# EAGLE design pcb-pick-plaz-led (EAGLE 9.6.2)
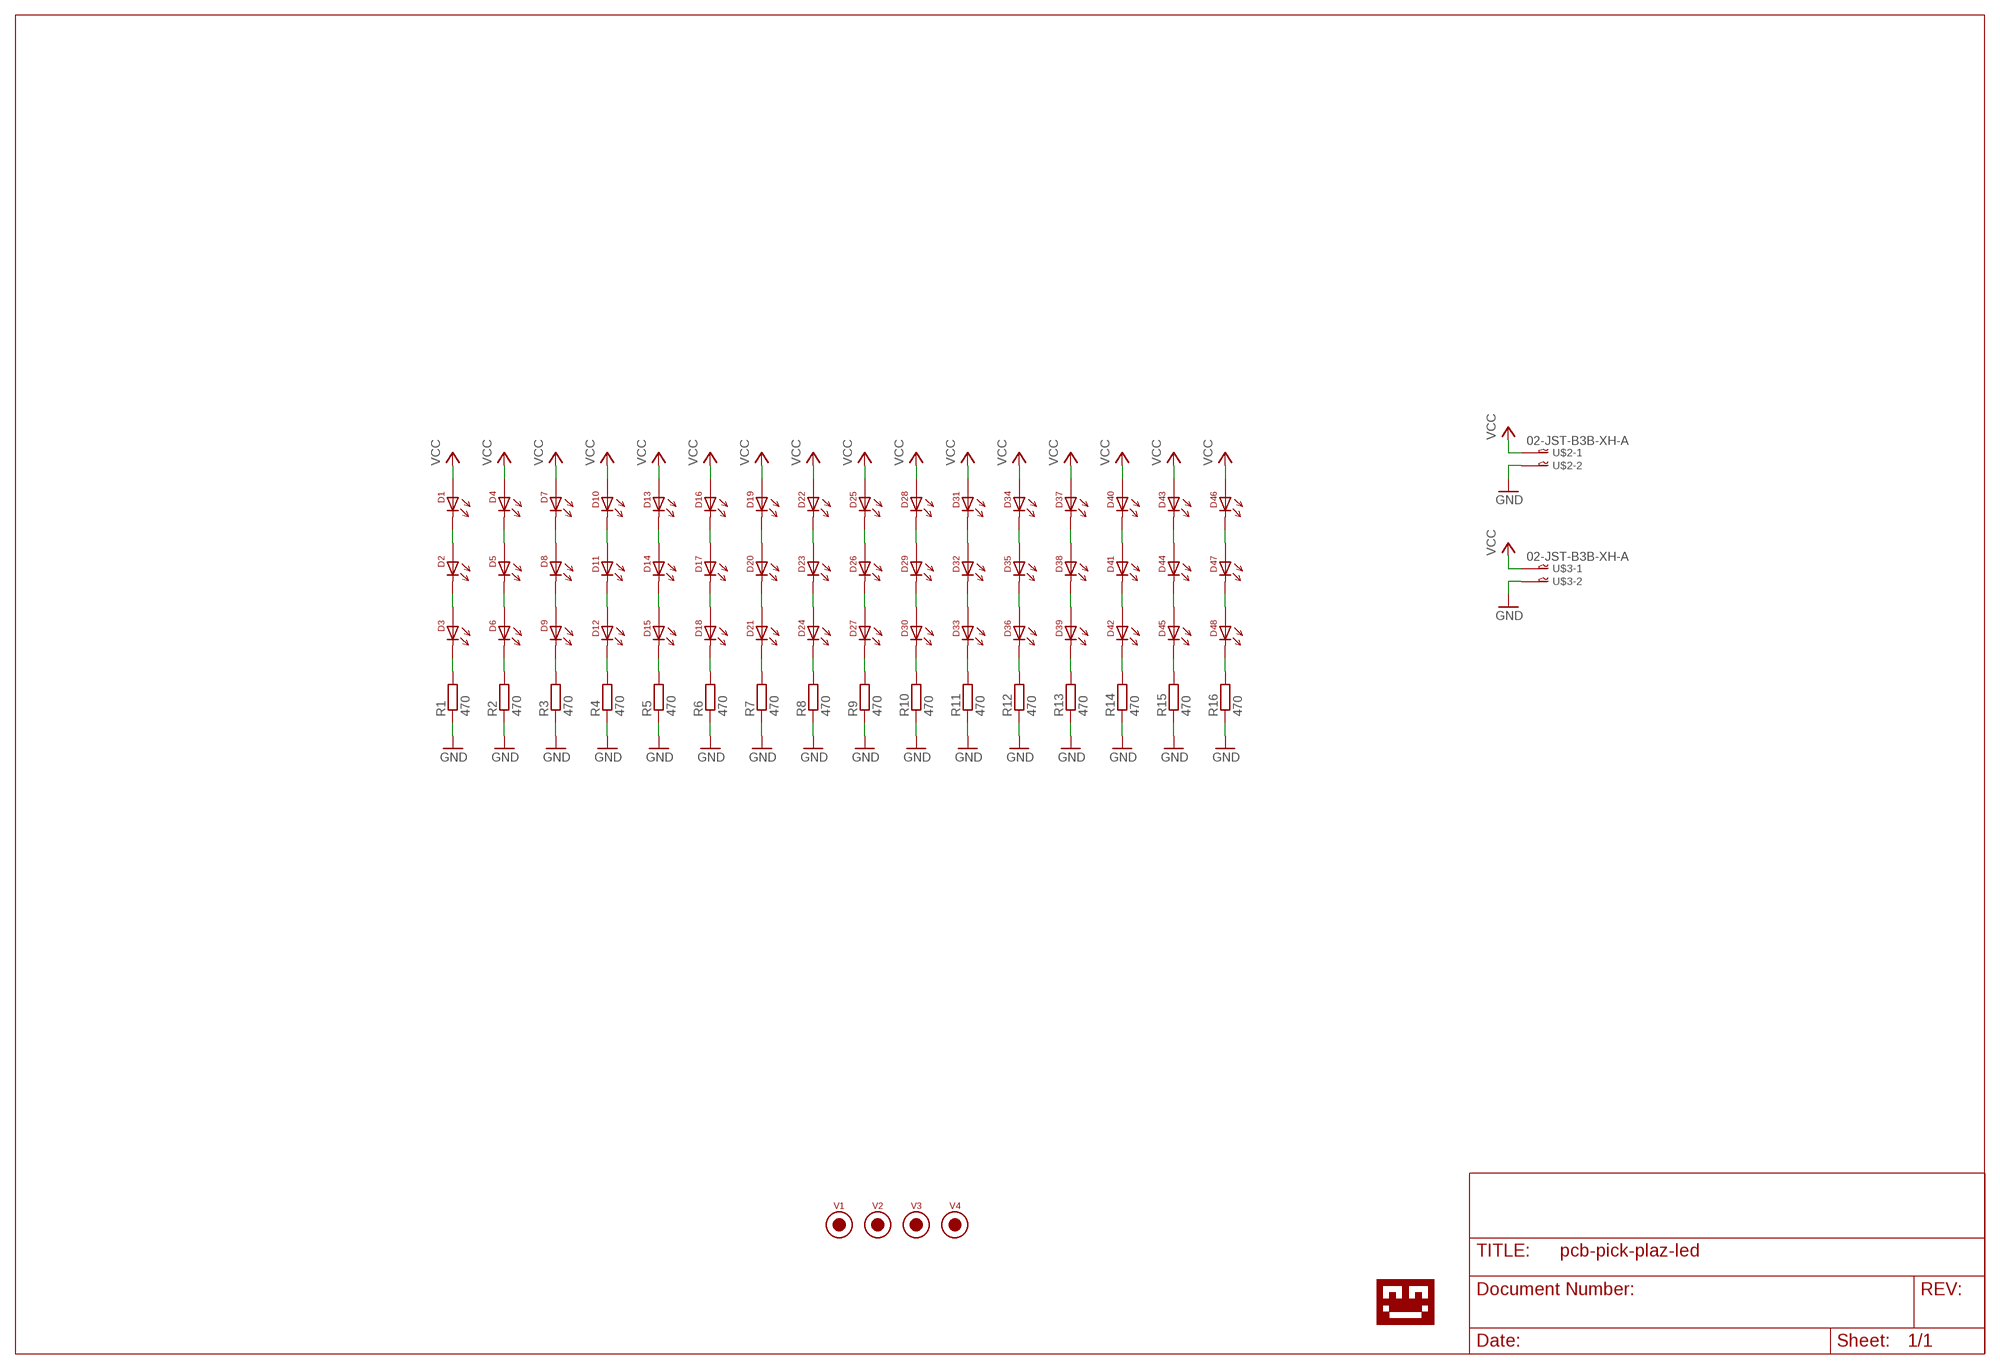
[diagram p0: schematic, sheet 1]

## Parts
D1  LED-5730  [5730-LED]
D2  LED-5730  [5730-LED]
D3  LED-5730  [5730-LED]
D4  LED-5730  [5730-LED]
D5  LED-5730  [5730-LED]
D6  LED-5730  [5730-LED]
D7  LED-5730  [5730-LED]
D8  LED-5730  [5730-LED]
D9  LED-5730  [5730-LED]
D10  LED-5730  [5730-LED]
D11  LED-5730  [5730-LED]
D12  LED-5730  [5730-LED]
D13  LED-5730  [5730-LED]
D14  LED-5730  [5730-LED]
D15  LED-5730  [5730-LED]
D16  LED-5730  [5730-LED]
D17  LED-5730  [5730-LED]
D18  LED-5730  [5730-LED]
D19  LED-5730  [5730-LED]
D20  LED-5730  [5730-LED]
D21  LED-5730  [5730-LED]
D22  LED-5730  [5730-LED]
D23  LED-5730  [5730-LED]
D24  LED-5730  [5730-LED]
D25  LED-5730  [5730-LED]
D26  LED-5730  [5730-LED]
D27  LED-5730  [5730-LED]
D28  LED-5730  [5730-LED]
D29  LED-5730  [5730-LED]
D30  LED-5730  [5730-LED]
D31  LED-5730  [5730-LED]
D32  LED-5730  [5730-LED]
D33  LED-5730  [5730-LED]
D34  LED-5730  [5730-LED]
D35  LED-5730  [5730-LED]
D36  LED-5730  [5730-LED]
D37  LED-5730  [5730-LED]
D38  LED-5730  [5730-LED]
D39  LED-5730  [5730-LED]
D40  LED-5730  [5730-LED]
D41  LED-5730  [5730-LED]
D42  LED-5730  [5730-LED]
D43  LED-5730  [5730-LED]
D44  LED-5730  [5730-LED]
D45  LED-5730  [5730-LED]
D46  LED-5730  [5730-LED]
D47  LED-5730  [5730-LED]
D48  LED-5730  [5730-LED]
R1  470  RESISTOR0805_RES  [0805_RES]
R2  470  RESISTOR0805_RES  [0805_RES]
R3  470  RESISTOR0805_RES  [0805_RES]
R4  470  RESISTOR0805_RES  [0805_RES]
R5  470  RESISTOR0805_RES  [0805_RES]
R6  470  RESISTOR0805_RES  [0805_RES]
R7  470  RESISTOR0805_RES  [0805_RES]
R8  470  RESISTOR0805_RES  [0805_RES]
R9  470  RESISTOR0805_RES  [0805_RES]
R10  470  RESISTOR0805_RES  [0805_RES]
R11  470  RESISTOR0805_RES  [0805_RES]
R12  470  RESISTOR0805_RES  [0805_RES]
R13  470  RESISTOR0805_RES  [0805_RES]
R14  470  RESISTOR0805_RES  [0805_RES]
R15  470  RESISTOR0805_RES  [0805_RES]
R16  470  RESISTOR0805_RES  [0805_RES]
U$1  LOGO-TOBENG-1MM-FINISH  [TOBENG-1MM-FINISH]
U$2  02-JST-B3B-XH-A  [B2B-XH]
U$3  02-JST-B3B-XH-A  [B2B-XH]
V1  FIDUCIAL2MM  [FIDUCIAL_2MM]
V2  FIDUCIAL2MM  [FIDUCIAL_2MM]
V3  FIDUCIAL2MM  [FIDUCIAL_2MM]
V4  FIDUCIAL2MM  [FIDUCIAL_2MM]

## Nets
GND: R1.1 R2.1 R3.1 R4.1 R5.1 R6.1 R7.1 R8.1 R9.1 R10.1 R11.1 R12.1 R13.1 R14.1 R15.1 R16.1 U$2.P$2 U$3.P$2
N$1: D1.C D2.A1 D2.A2
N$2: D2.C D3.A1 D3.A2
N$3: D3.C R1.2
N$4: D4.C D5.A1 D5.A2
N$5: D5.C D6.A1 D6.A2
N$6: D6.C R2.2
N$7: D7.C D8.A1 D8.A2
N$8: D8.C D9.A1 D9.A2
N$9: D9.C R3.2
N$10: D10.C D11.A1 D11.A2
N$11: D11.C D12.A1 D12.A2
N$12: D12.C R4.2
N$13: D13.C D14.A1 D14.A2
N$14: D14.C D15.A1 D15.A2
N$15: D15.C R5.2
N$16: D16.C D17.A1 D17.A2
N$17: D17.C D18.A1 D18.A2
N$18: D18.C R6.2
N$19: D19.C D20.A1 D20.A2
N$20: D20.C D21.A1 D21.A2
N$21: D21.C R7.2
N$22: D22.C D23.A1 D23.A2
N$23: D23.C D24.A1 D24.A2
N$24: D24.C R8.2
N$25: D25.C D26.A1 D26.A2
N$26: D26.C D27.A1 D27.A2
N$27: D27.C R9.2
N$28: D28.C D29.A1 D29.A2
N$29: D29.C D30.A1 D30.A2
N$30: D30.C R10.2
N$31: D31.C D32.A1 D32.A2
N$32: D32.C D33.A1 D33.A2
N$33: D33.C R11.2
N$34: D34.C D35.A1 D35.A2
N$35: D35.C D36.A1 D36.A2
N$36: D36.C R12.2
N$37: D37.C D38.A1 D38.A2
N$38: D38.C D39.A1 D39.A2
N$39: D39.C R13.2
N$40: D40.C D41.A1 D41.A2
N$41: D41.C D42.A1 D42.A2
N$42: D42.C R14.2
N$43: D43.C D44.A1 D44.A2
N$44: D44.C D45.A1 D45.A2
N$45: D45.C R15.2
N$46: D46.C D47.A1 D47.A2
N$47: D47.C D48.A1 D48.A2
N$48: D48.C R16.2
VCC: D1.A1 D1.A2 D4.A1 D4.A2 D7.A1 D7.A2 D10.A1 D10.A2 D13.A1 D13.A2 D16.A1 D16.A2 D19.A1 D19.A2 D22.A1 D22.A2 D25.A1 D25.A2 D28.A1 D28.A2 D31.A1 D31.A2 D34.A1 D34.A2 D37.A1 D37.A2 D40.A1 D40.A2 D43.A1 D43.A2 D46.A1 D46.A2 U$2.P$1 U$3.P$1

## Library data of the parts
D1-D48 = ftobler:LED
R1-R16 = passives:RESISTOR: Resistor Basic schematic elements and footprints for 0201, 0402, 0603, 1206, and PTH resistors.
U$1 = ftobler:LOGO
U$2 U$3 = bt_con-jst-xh:02-JST: JST CONNECTOR
V1-V4 = ftobler:FIDUCIAL

## Board
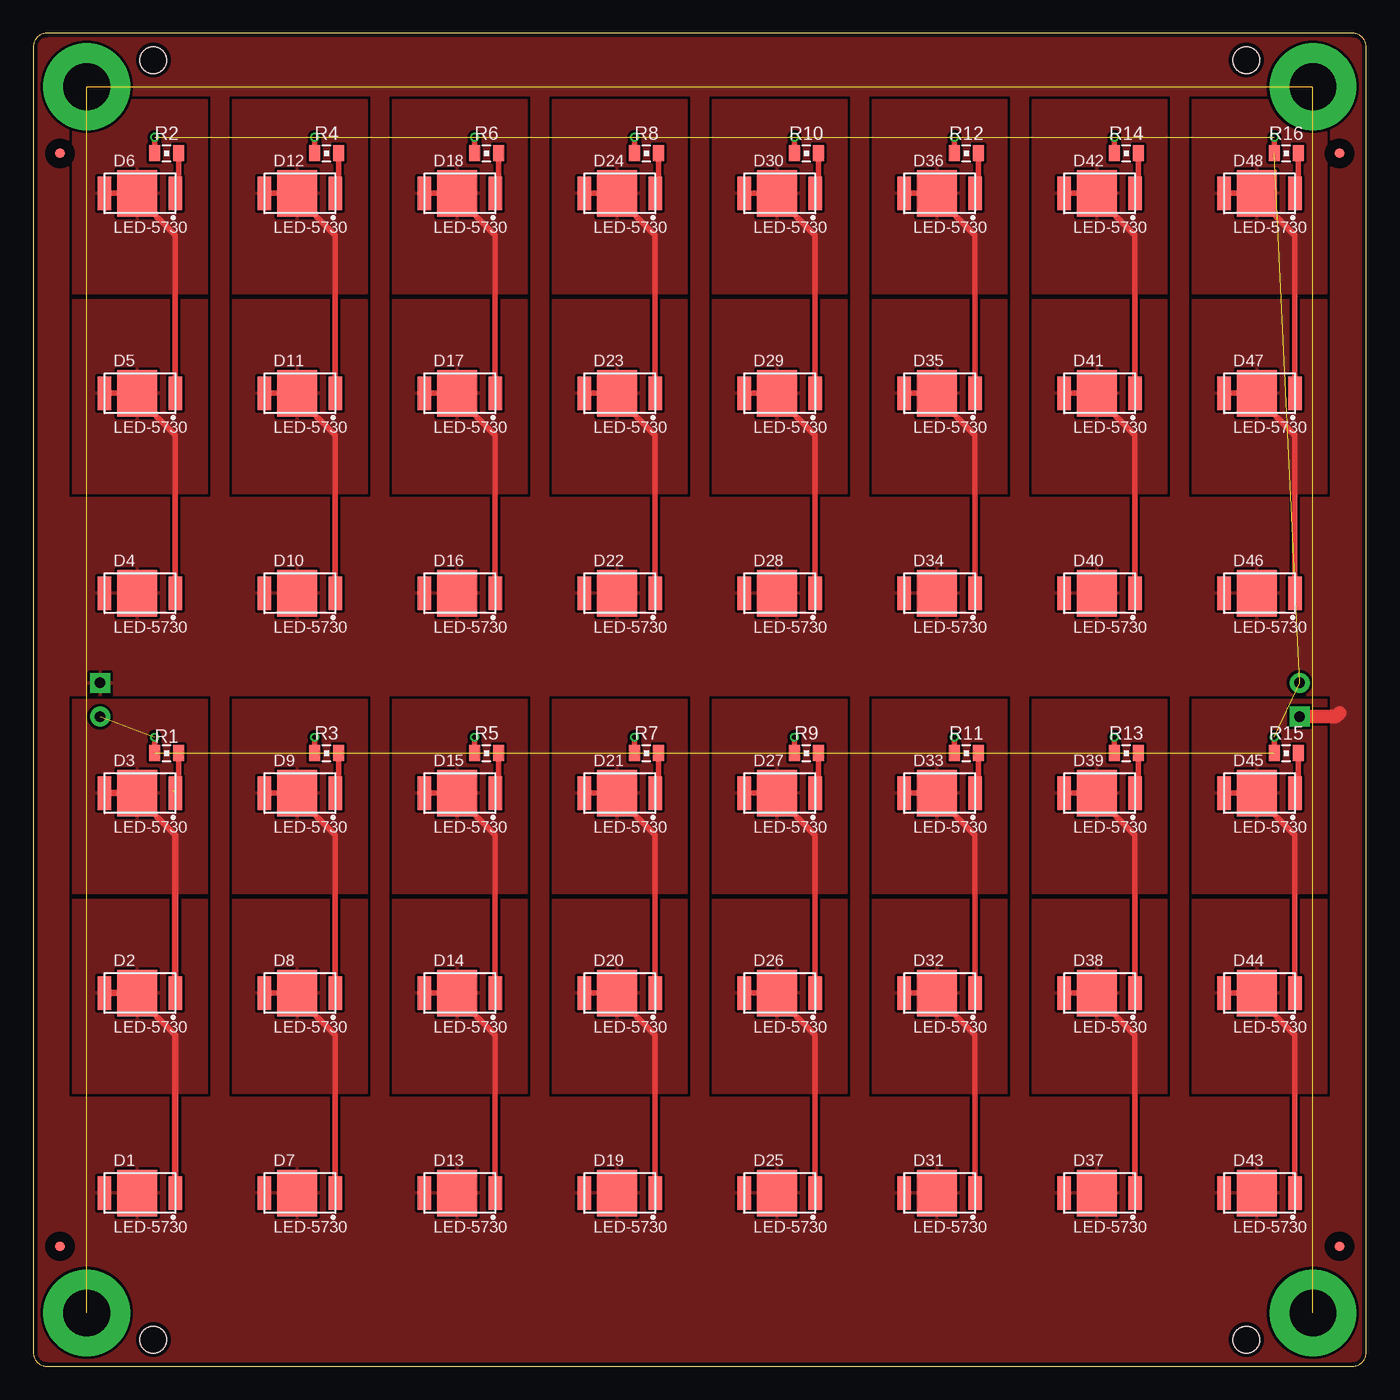
[diagram p1: board, top side]
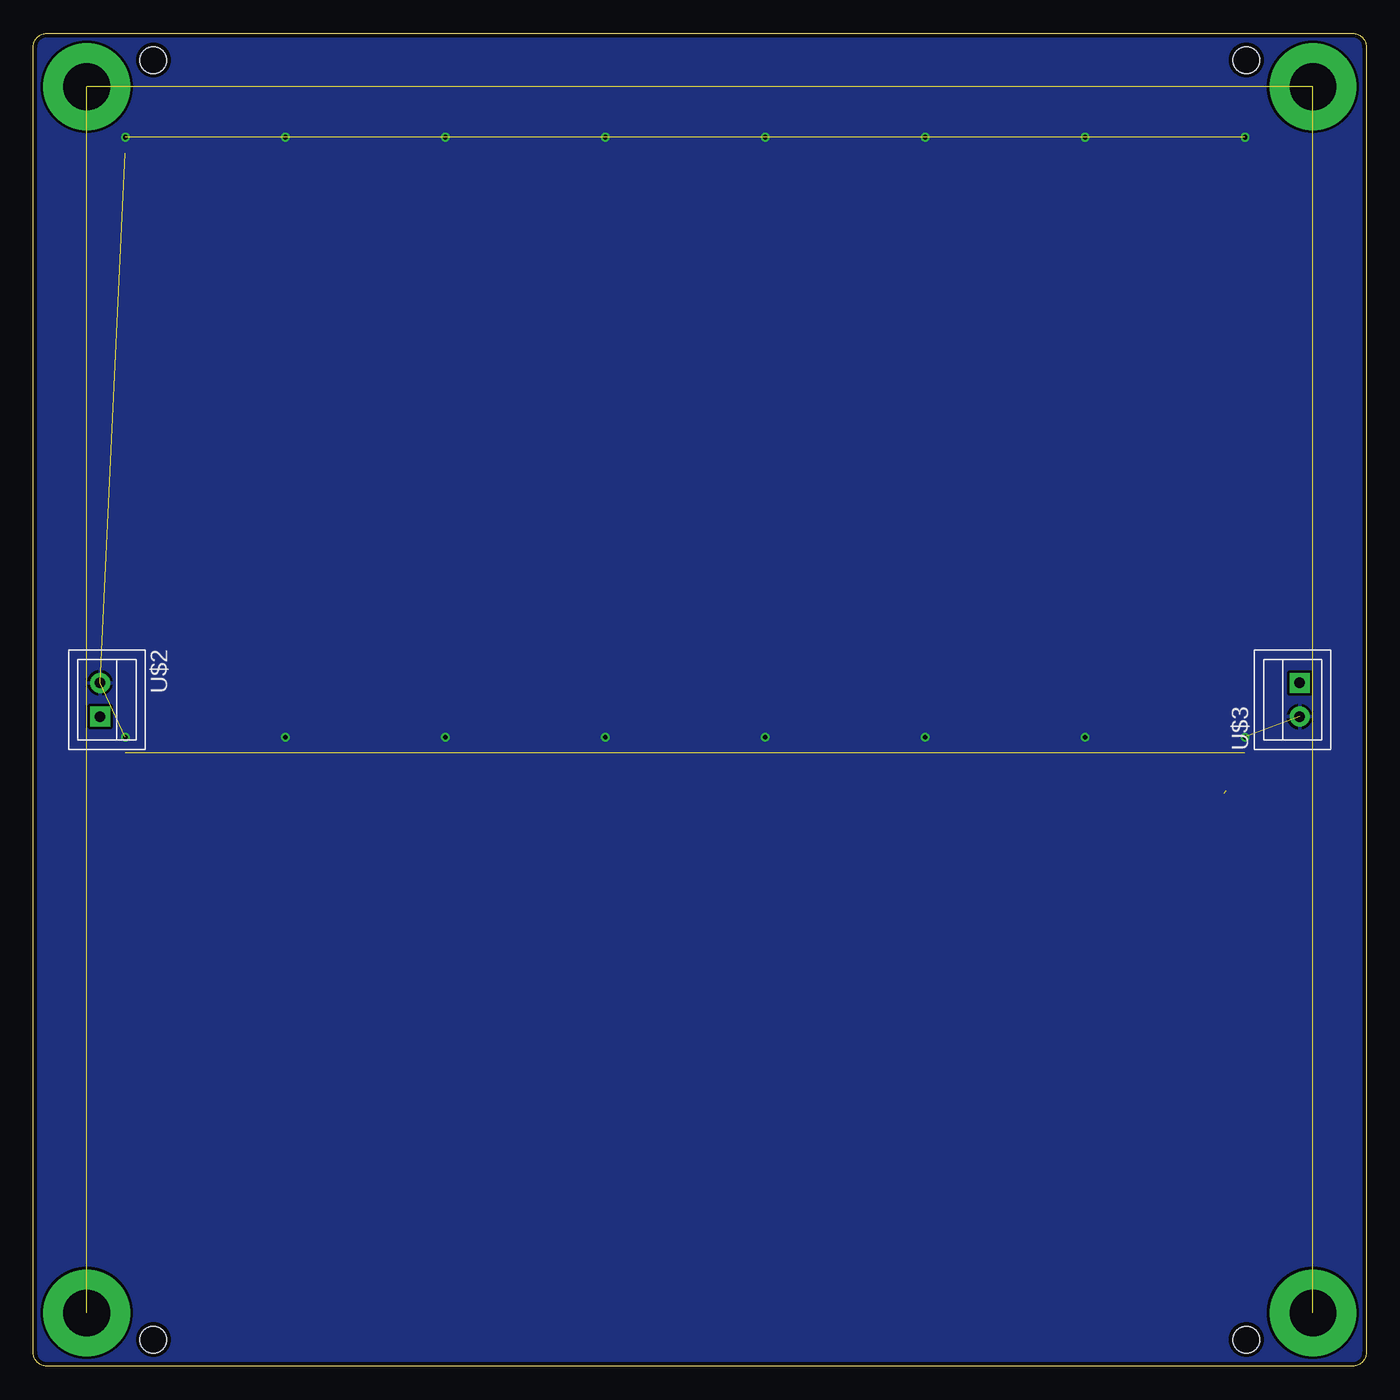
[diagram p2: board, bottom side, seen from below]

Size 100 x 100 mm. Coordinates in mm from the lower left corner, seen from the top.
Outline: 0,99 0,1 arc90 1,0 99,0 arc90 100,1 100,99 arc90 99,100 1,100 arc90 0,99
Copper layers (1*16): Top 0.035mm / dielectric 1.5mm / Bottom 0.035mm
Design rules "default *": minimum track width 0.2mm, minimum drill 0.3mm, track to track 0.2mm, track to pad 0.2mm, pad to pad 0.2mm, via to via 0.2mm, smd to smd 0.2mm, copper to edge 0.3mm, drill to drill 10mil, minimum pad ring 0.15mm, minimum via ring 0.15mm, stop-mask expansion 0.05mm, vias tented up to drill 0.35mm, thermal gap 0.2mm
Holes 2 mm at 9,98 91,98 91,2 9,2

### Footprints (pad centres in the part's own frame; a part is rotated, then mirrored left to right if it is on the bottom)
5730-LED = smd 1 x 2.5: A1 -2.66,0; C 2.66,0 | smd 3 x 3.5: A2 -0.215,0
0805_RES = smd 0.8 x 1.2: 1 -0.9,0; 2 0.9,0
B2B-XH = drill 0.8 pad 1.5 square: P$1 1.27,0 | drill 0.8 pad 1.5: P$2 -1.27,0
FIDUCIAL_2MM = smd 0.7 x 0.7: V 0,0

### Placement (x,y rotation side)
D1  8,13 0 top
D2  8,28 0 top
D3  8,43 0 top
D4  8,58 0 top
D5  8,73 0 top
D6  8,88 0 top
D7  20,13 0 top
D8  20,28 0 top
D9  20,43 0 top
D10  20,58 0 top
D11  20,73 0 top
D12  20,88 0 top
D13  32,13 0 top
D14  32,28 0 top
D15  32,43 0 top
D16  32,58 0 top
D17  32,73 0 top
D18  32,88 0 top
D19  44,13 0 top
D20  44,28 0 top
D21  44,43 0 top
D22  44,58 0 top
D23  44,73 0 top
D24  44,88 0 top
D25  56,13 0 top
D26  56,28 0 top
D27  56,43 0 top
D28  56,58 0 top
D29  56,73 0 top
D30  56,88 0 top
D31  68,13 0 top
D32  68,28 0 top
D33  68,43 0 top
D34  68,58 0 top
D35  68,73 0 top
D36  68,88 0 top
D37  80,13 0 top
D38  80,28 0 top
D39  80,43 0 top
D40  80,58 0 top
D41  80,73 0 top
D42  80,88 0 top
D43  92,13 0 top
D44  92,28 0 top
D45  92,43 0 top
D46  92,58 0 top
D47  92,73 0 top
D48  92,88 0 top
R1  10,46 0 top
R2  10,91 0 top
R3  22,46 0 top
R4  22,91 0 top
R5  34,46 0 top
R6  34,91 0 top
R7  46,46 0 top
R8  46,91 0 top
R9  58,46 0 top
R10  58,91 0 top
R11  70,46 0 top
R12  70,91 0 top
R13  82,46 0 top
R14  82,91 0 top
R15  94,46 0 top
R16  94,91 0 top
U$1  50,50 0 top
U$2  95,50 270 bottom
U$3  5,50 90 bottom
V1  2,9 0 top
V2  98,9 0 top
V3  98,91 0 top
V4  2,91 0 top

### Tracks (layer width: path | path; a pad name or v marks a point on that pad's centre or on a via)
GND  (via drill 0.35)  (17 unrouted)
  Top 0.4: R1.1 v9.1,47.2 | R15.1 v93.1,47.2 | R13.1 v81.1,47.2 | R11.1 v69.1,47.2 | R9.1 v57.1,47.2 | R7.1 v45.1,47.2 | R5.1 v33.1,47.2 | R3.1 v21.1,47.2 | R2.1 v9.1,92.2 | R16.1 v93.1,92.2 | R14.1 v81.1,92.2 | R12.1 v69.1,92.2 | R10.1 v57.1,92.2 | R8.1 v45.1,92.2 | R6.1 v33.1,92.2 | R4.1 v21.1,92.2
  pour Bottom: -2,102 101,102 101,-1 -2,-1
GND1  (via drill 3.5 pad 6.5)  (3 unrouted)
  other vias: 4,96 96,96 96,4 4,4
N$1
  Top 0.5: D2.A1 D2.A2 7.79,27.75 10.66,24.88 D1.C
  pour Top: 3,20.5 3,35 13,35 13,20.5
N$2
  Top 0.5: D3.A1 D3.A2 7.79,42.75 10.66,39.88 D2.C
  pour Top: 3,35.5 3,50 13,50 13,35.5
N$3  (1 unrouted)
  Top 0.4: R1.2 10.9,43.6 10.5,43.2
  Top 0.5: D3.C
N$4
  Top 0.4: D4.C 10.66,69.88 7.79,72.75 D5.A2 D5.A1
  pour Top: 3,65.5 3,80 13,80 13,65.5
N$5
  Top 0.4: D5.C 10.66,84.88 7.79,87.75 D6.A2 D6.A1
  pour Top: 3,80.5 3,95 13,95 13,80.5
N$6
  Top 0.4: R2.2 10.9,88.24 D6.C
N$7
  Top 0.4: D7.C 22.66,24.88 19.79,27.75 D8.A2 D8.A1
  pour Top: 15,20.5 15,35 25,35 25,20.5
N$8
  Top 0.4: D8.C 22.66,39.88 19.79,42.75 D9.A2 D9.A1
  pour Top: 15,35.5 15,50 25,50 25,35.5
N$9
  Top 0.4: R3.2 22.9,43.24 D9.C
N$10
  Top 0.4: D10.C 22.66,69.88 19.79,72.75 D11.A2 D11.A1
  pour Top: 15,65.5 15,80 25,80 25,65.5
N$11
  Top 0.4: D11.C 22.66,84.88 19.79,87.75 D12.A2 D12.A1
  pour Top: 15,80.5 15,95 25,95 25,80.5
N$12
  Top 0.4: R4.2 22.9,88.24 D12.C
N$13
  Top 0.4: D13.C 34.66,24.88 31.79,27.75 D14.A2 D14.A1
  pour Top: 27,20.5 27,35 37,35 37,20.5
N$14
  Top 0.4: D14.C 34.66,39.88 31.79,42.75 D15.A2 D15.A1
  pour Top: 27,35.5 27,50 37,50 37,35.5
N$15
  Top 0.4: R5.2 34.9,43.24 D15.C
N$16
  Top 0.4: D16.C 34.66,69.88 31.79,72.75 D17.A2 D17.A1
  pour Top: 27,65.5 27,80 37,80 37,65.5
N$17
  Top 0.4: D17.C 34.66,84.88 31.79,87.75 D18.A2 D18.A1
  pour Top: 27,80.5 27,95 37,95 37,80.5
N$18
  Top 0.4: R6.2 34.9,88.24 D18.C
N$19
  Top 0.4: D19.C 46.66,24.88 43.78,27.75 D20.A2 D20.A1
  pour Top: 39,20.5 39,35 49,35 49,20.5
N$20
  Top 0.4: D20.C 46.66,39.88 43.78,42.75 D21.A2 D21.A1
  pour Top: 39,35.5 39,50 49,50 49,35.5
N$21
  Top 0.4: R7.2 46.9,43.24 D21.C
N$22
  Top 0.4: D22.C 46.66,69.88 43.78,72.75 D23.A2 D23.A1
  pour Top: 39,65.5 39,80 49,80 49,65.5
N$23
  Top 0.4: D23.C 46.66,84.88 43.78,87.75 D24.A2 D24.A1
  pour Top: 39,80.5 39,95 49,95 49,80.5
N$24
  Top 0.4: R8.2 46.9,88.24 D24.C
N$25
  Top 0.4: D25.C 58.66,24.88 55.78,27.75 D26.A2 D26.A1
  pour Top: 51,20.5 51,35 61,35 61,20.5
N$26
  Top 0.4: D26.C 58.66,39.88 55.78,42.75 D27.A2 D27.A1
  pour Top: 51,35.5 51,50 61,50 61,35.5
N$27
  Top 0.4: R9.2 58.9,43.24 D27.C
N$28
  Top 0.4: D28.C 58.66,69.88 55.78,72.75 D29.A2 D29.A1
  pour Top: 51,65.5 51,80 61,80 61,65.5
N$29
  Top 0.4: D29.C 58.66,84.88 55.78,87.75 D30.A2 D30.A1
  pour Top: 51,80.5 51,95 61,95 61,80.5
N$30
  Top 0.4: R10.2 58.9,88.24 D30.C
N$31
  Top 0.4: D31.C 70.66,24.88 67.78,27.75 D32.A2 D32.A1
  pour Top: 63,20.5 63,35 73,35 73,20.5
N$32
  Top 0.4: D32.C 70.66,39.88 67.78,42.75 D33.A2 D33.A1
  pour Top: 63,35.5 63,50 73,50 73,35.5
N$33
  Top 0.4: R11.2 70.9,43.24 D33.C
N$34
  Top 0.4: D34.C 70.66,69.88 67.78,72.75 D35.A2 D35.A1
  pour Top: 63,65.5 63,80 73,80 73,65.5
N$35
  Top 0.4: D35.C 70.66,84.88 67.78,87.75 D36.A2 D36.A1
  pour Top: 63,80.5 63,95 73,95 73,80.5
N$36
  Top 0.4: R12.2 70.9,88.24 D36.C
N$37
  Top 0.4: D37.C 82.66,24.88 79.78,27.75 D38.A2 D38.A1
  pour Top: 75,20.5 75,35 85,35 85,20.5
N$38
  Top 0.4: D38.C 82.66,39.88 79.78,42.75 D39.A2 D39.A1
  pour Top: 75,35.5 75,50 85,50 85,35.5
N$39
  Top 0.4: R13.2 82.9,43.24 D39.C
N$40
  Top 0.4: D40.C 82.66,69.88 79.78,72.75 D41.A2 D41.A1
  pour Top: 75,65.5 75,80 85,80 85,65.5
N$41
  Top 0.4: D41.C 82.66,84.88 79.78,87.75 D42.A2 D42.A1
  pour Top: 75,80.5 75,95 85,95 85,80.5
N$42
  Top 0.4: R14.2 82.9,88.24 D42.C
N$43
  Top 0.4: D43.C 94.66,24.88 91.78,27.75 D44.A2 D44.A1
  pour Top: 87,20.5 87,35 97,35 97,20.5
N$44
  Top 0.4: D44.C 94.66,39.88 91.78,42.75 D45.A2 D45.A1
  pour Top: 87,35.5 87,50 97,50 97,35.5
N$45
  Top 0.4: R15.2 94.9,43.24 D45.C
N$46
  Top 0.4: D46.C 94.66,69.88 91.78,72.75 D47.A2 D47.A1
  pour Top: 87,65.5 87,80 97,80 97,65.5
N$47
  Top 0.4: D47.C 94.66,84.88 91.78,87.75 D48.A2 D48.A1
  pour Top: 87,80.5 87,95 97,95 97,80.5
N$48
  Top 0.4: R16.2 94.9,88.24 D48.C
VCC
  Top 1: U$2.P$1 97.73,48.73 98,49
  Bottom 1: U$2.P$1 95.07,48.8
  pour Top (rank 2): -1,101 102,101 102,-2 -1,-2

### Text on the board
tFinish: pcb-pick-plaz-led v1 / by ftobler 2021 | JLCJLCJLCJLC